# Altium schematic sheet Audio_SpeakerDriver.SchDoc
size A4; SheetNumber: 3; SheetTotal: 6
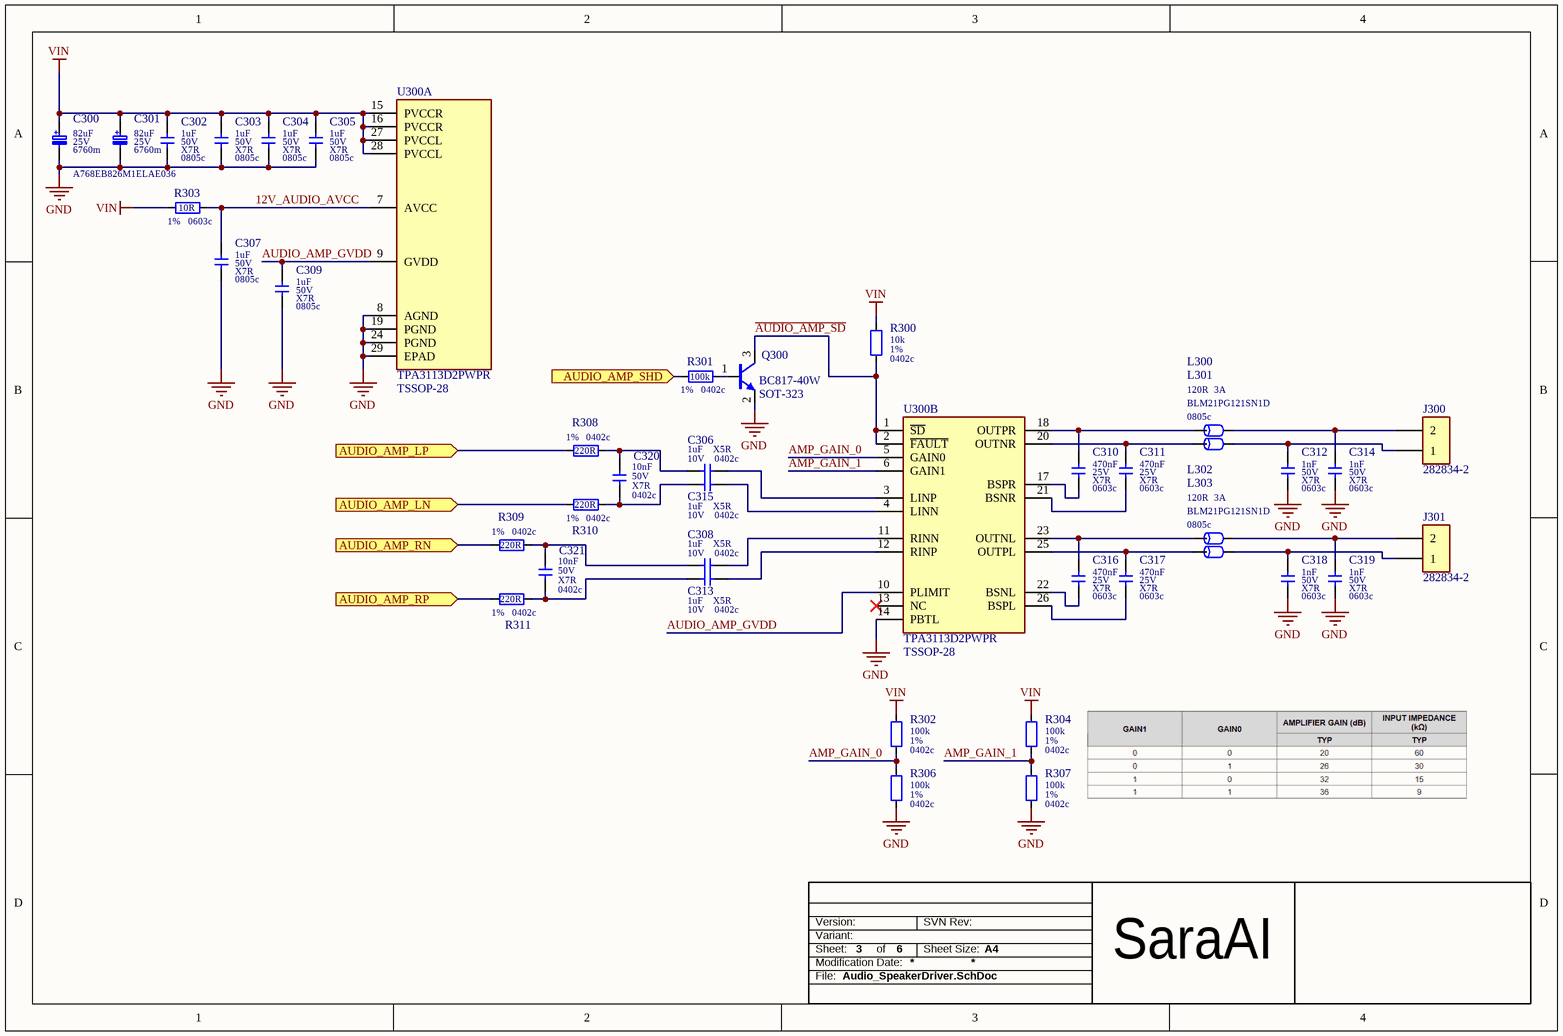
[diagram p0: Audio_SpeakerDriver.SchDoc]

## Parts
C300  09 Parameter 2: 25V  08 Parameter 1: 82uF  07 Package: 6760m  [CAPAE660X60L]  (hidden comment: A768EB826M1ELAE036)
C301  09 Parameter 2: 25V  08 Parameter 1: 82uF  07 Package: 6760m  [CAPAE660X60L]  (hidden comment: A768EB826M1ELAE036)
C302  11 Parameter 4: X7R  07 Package: 0805c  08 Parameter 1: 1uF  09 Parameter 2: 50V  [CAPC2013X145L]  (hidden comment: CL21B105KBFNNNG)
C303  11 Parameter 4: X7R  07 Package: 0805c  08 Parameter 1: 1uF  09 Parameter 2: 50V  [CAPC2013X145L]  (hidden comment: CL21B105KBFNNNG)
C304  11 Parameter 4: X7R  07 Package: 0805c  08 Parameter 1: 1uF  09 Parameter 2: 50V  [CAPC2013X145L]  (hidden comment: CL21B105KBFNNNG)
C305  11 Parameter 4: X7R  07 Package: 0805c  08 Parameter 1: 1uF  09 Parameter 2: 50V  [CAPC2013X145L]  (hidden comment: CL21B105KBFNNNG)
C306  11 Parameter 4: X5R  07 Package: 0402c  08 Parameter 1: 1uF  09 Parameter 2: 10V  [CAPC1005X60L]  (hidden comment: CL05A105KP5NNNC)
C307  11 Parameter 4: X7R  07 Package: 0805c  08 Parameter 1: 1uF  09 Parameter 2: 50V  [CAPC2013X145L]  (hidden comment: CL21B105KBFNNNG)
C308  11 Parameter 4: X5R  07 Package: 0402c  08 Parameter 1: 1uF  09 Parameter 2: 10V  [CAPC1005X60L]  (hidden comment: CL05A105KP5NNNC)
C309  11 Parameter 4: X7R  07 Package: 0805c  08 Parameter 1: 1uF  09 Parameter 2: 50V  [CAPC2013X145L]  (hidden comment: CL21B105KBFNNNG)
C310  11 Parameter 4: X7R  07 Package: 0603c  08 Parameter 1: 470nF  09 Parameter 2: 25V  [CAPC1608X90L]  (hidden comment: CL10B474KA8NNNC)
C311  11 Parameter 4: X7R  07 Package: 0603c  08 Parameter 1: 470nF  09 Parameter 2: 25V  [CAPC1608X90L]  (hidden comment: CL10B474KA8NNNC)
C312  11 Parameter 4: X7R  07 Package: 0603c  08 Parameter 1: 1nF  09 Parameter 2: 50V  [CAPC1608X90L]  (hidden comment: CL10B102KB8NNNC)
C313  11 Parameter 4: X5R  07 Package: 0402c  08 Parameter 1: 1uF  09 Parameter 2: 10V  [CAPC1005X60L]  (hidden comment: CL05A105KP5NNNC)
C314  11 Parameter 4: X7R  07 Package: 0603c  08 Parameter 1: 1nF  09 Parameter 2: 50V  [CAPC1608X90L]  (hidden comment: CL10B102KB8NNNC)
C315  11 Parameter 4: X5R  07 Package: 0402c  08 Parameter 1: 1uF  09 Parameter 2: 10V  [CAPC1005X60L]  (hidden comment: CL05A105KP5NNNC)
C316  11 Parameter 4: X7R  07 Package: 0603c  08 Parameter 1: 470nF  09 Parameter 2: 25V  [CAPC1608X90L]  (hidden comment: CL10B474KA8NNNC)
C317  11 Parameter 4: X7R  07 Package: 0603c  08 Parameter 1: 470nF  09 Parameter 2: 25V  [CAPC1608X90L]  (hidden comment: CL10B474KA8NNNC)
C318  11 Parameter 4: X7R  07 Package: 0603c  08 Parameter 1: 1nF  09 Parameter 2: 50V  [CAPC1608X90L]  (hidden comment: CL10B102KB8NNNC)
C319  11 Parameter 4: X7R  07 Package: 0603c  08 Parameter 1: 1nF  09 Parameter 2: 50V  [CAPC1608X90L]  (hidden comment: CL10B102KB8NNNC)
C320  11 Parameter 4: X7R  07 Package: 0402c  08 Parameter 1: 10nF  09 Parameter 2: 50V  [CAPC1005X60L]  (hidden comment: CL05B103KB5NNN)
C321  11 Parameter 4: X7R  07 Package: 0402c  08 Parameter 1: 10nF  09 Parameter 2: 50V  [CAPC1005X60L]  (hidden comment: CL05B103KB5NNN)
J300  282834-2  [TE 282834-2]
J301  282834-2  [TE 282834-2]
L300  09 Parameter 2: 3A  08 Parameter 1: 120R  07 Package: 0805c  [INDC2013X105L]  (hidden comment: BLM21PG121SN1D)
L301  BLM21PG121SN1D  [INDC2013X105L]  (value not drawn)
L302  09 Parameter 2: 3A  08 Parameter 1: 120R  07 Package: 0805c  [INDC2013X105L]  (hidden comment: BLM21PG121SN1D)
L303  BLM21PG121SN1D  [INDC2013X105L]  (value not drawn)
Q300  07 Package: SOT-323  [SOT65P210X110-3L]  (hidden comment: BC817-40W)
R300  07 Package: 0402c  09 Parameter 2: 1%  08 Parameter 1: 10k  [RESC1005X40L]  (hidden comment: RC0402FR-0710KL)
R301  07 Package: 0402c  09 Parameter 2: 1%  08 Parameter 1: 100k  [RESC1005X40L]  (hidden comment: RC0402FR-07100KL)
R302  07 Package: 0402c  09 Parameter 2: 1%  08 Parameter 1: 100k  [RESC1005X40L]  (hidden comment: RC0402FR-07100KL)
R303  07 Package: 0603c  09 Parameter 2: 1%  08 Parameter 1: 10R  [RESC1608X55L]  (hidden comment: RC0603FR-0710RL)
R304  07 Package: 0402c  09 Parameter 2: 1%  08 Parameter 1: 100k  [RESC1005X40L]  (hidden comment: RC0402FR-07100KL)
R306  07 Package: 0402c  09 Parameter 2: 1%  08 Parameter 1: 100k  [RESC1005X40L]  (hidden comment: RC0402FR-07100KL)
R307  07 Package: 0402c  09 Parameter 2: 1%  08 Parameter 1: 100k  [RESC1005X40L]  (hidden comment: RC0402FR-07100KL)
R308  07 Package: 0402c  09 Parameter 2: 1%  08 Parameter 1: 220R  [RESC1005X40L]  (hidden comment: RC0402FR-07220RL)
R309  07 Package: 0402c  09 Parameter 2: 1%  08 Parameter 1: 220R  [RESC1005X40L]  (hidden comment: RC0402FR-07220RL)
R310  07 Package: 0402c  09 Parameter 2: 1%  08 Parameter 1: 220R  [RESC1005X40L]  (hidden comment: RC0402FR-07220RL)
R311  07 Package: 0402c  09 Parameter 2: 1%  08 Parameter 1: 220R  [RESC1005X40L]  (hidden comment: RC0402FR-07220RL)
U300  07 Package: TSSOP-28  [TSOP65P640X120_HS-29L]  (hidden comment: TPA3113D2PWPR)  (parts A,B of 2)

## Ports
AUDIO_AMP_LN (in), AUDIO_AMP_LP (in), AUDIO_AMP_RN (in), AUDIO_AMP_RP (in), AUDIO_AMP_SHD (in)

## Nets
GND: C300.2 C301.2 C302.1 C303.1 C304.1 C305.1 C307.1 C309.1 C312.1 C314.1 C318.1 C319.1 Q300.2(E) R306.1 R307.1 U300.8(AGND) U300.14(PBTL) U300.19(PGND) U300.24(PGND) U300.29(EPAD)
VIN: C300.1 C301.1 C302.2 C303.2 C304.2 C305.2 R300.2 R302.2 R303.1 R304.2 U300.15(PVCCR) U300.16(PVCCR) U300.27(PVCCL) U300.28(PVCCL)
12V_AUDIO_AVCC: C307.2 R303.2 U300.7(AVCC)
~{AUDIO_AMP_SD}: Q300.3(C) R300.1 U300.1(~{SD}) U300.2(~{FAULT})
AMP_GAIN_0: R302.1 R306.2 U300.5(GAIN0)
AMP_GAIN_1: R304.1 R307.2 U300.6(GAIN1)
AUDIO_AMP_GVDD: C309.2 U300.9(GVDD) U300.10(PLIMIT)
AUDIO_AMP_LN: R310.1 ; port AUDIO_AMP_LN
AUDIO_AMP_LP: R308.1 ; port AUDIO_AMP_LP
AUDIO_AMP_RN: R309.1 ; port AUDIO_AMP_RN
AUDIO_AMP_RP: R311.1 ; port AUDIO_AMP_RP
AUDIO_AMP_SHD: R301.1 ; port AUDIO_AMP_SHD
NetC306_1: C306.1 U300.3(LINP)
NetC306_2: C306.2 C320.2 R308.2
NetC308_1: C308.1 U300.11(RINN)
NetC308_2: C308.2 C321.2 R309.2
NetC310_1: C310.1 U300.17(BSPR)
NetC310_2: C310.2 L300.1 U300.18(OUTPR)
NetC311_1: C311.1 U300.21(BSNR)
NetC311_2: C311.2 L301.1 U300.20(OUTNR)
NetC312_2: C312.2 J300.1 L301.2
NetC313_1: C313.1 U300.12(RINP)
NetC313_2: C313.2 C321.1 R311.2
NetC314_2: C314.2 J300.2 L300.2
NetC315_1: C315.1 U300.4(LINN)
NetC315_2: C315.2 C320.1 R310.2
NetC316_1: C316.1 U300.22(BSNL)
NetC316_2: C316.2 L302.1 U300.23(OUTNL)
NetC317_1: C317.1 U300.26(BSPL)
NetC317_2: C317.2 L303.1 U300.25(OUTPL)
NetC318_2: C318.2 J301.1 L303.2
NetC319_2: C319.2 J301.2 L302.2
NetQ300_1: Q300.1(B) R301.2

Not connected (* = marked no-connect by the designer): U300 13(NC)*

## Notes on the sheet
- Version:
- SVN Rev:
- Sheet:
- File:
- Modification Date:
- Variant:
- of
- Sheet Size:
- A4
- SaraAI
- (in symbol 498) +

## Library data of the parts
C300 C301 = 498: SMT 6760m 82uF 25V 0,2 36mOhm 1.255A 125°; 03 Manufacturer: Kemet; 00 Index: 498; 01 Name: CAPACITOR POLYMER A768EB826M1ELAE036 Kemet; 04 Main Group: CAPACITOR; 05 Sub Group: POLYMER; 10 Parameter 3: 0,2; 16 Replacements: 25SVPK82M; Library Directory: sym_basics/; Fotprint Directory: fot_ipc/; 06 Assembly: SMT; 11 Parameter 4: 36mOhm; 12 Parameter 5: 1.255A; 13 Parameter 6: 125°; 14 Modification Date: 09.03.2021; ComponentLink1Description: DATASHEET; ComponentLink1URL: https://pl.mouser.com/datasheet/2/212/1/KEM_A4088_A768-1864506.pdf; 02 MPN: A768EB826M1ELAE036
C302-C305 C307 C309 = 30: SMT 0805c 1uF 50V 10% X7R 6.9MHz 125'C; 03 Manufacturer: Samsung; 00 Index: 30; 01 Name: CAPACITOR CERAMIC CL21B105KBFNNNG Samsung; 05 Sub Group: CERAMIC; 04 Main Group: CAPACITOR; 06 Assembly: SMT; 12 Parameter 5: 6.9MHz; 13 Parameter 6: 125'C; 14 Modification Date: 16.11.2020; ComponentLink1Description: DATASHEET; ComponentLink1URL: E:\Praca\Mindsailors\Mindsailors Altium\Database Library\Datasheets\CAPACITOR\Samsung CL21B105KBFNNNG.pdf; 02 MPN: CL21B105KBFNNNG; 10 Parameter 3: 10%
C306 C308 C313 C315 = 154: SMT 0402c 1uF 10V 10% X5R 10.2MHz 85'C; 03 Manufacturer: Samsung; 00 Index: 154; 01 Name: CAPACITOR THICK FILM CL05A105KP5NNNC Samsung; 05 Sub Group: THICK FILM; 04 Main Group: CAPACITOR; 06 Assembly: SMT; 12 Parameter 5: 10.2MHz; 13 Parameter 6: 85'C; 14 Modification Date: 16.11.2020; ComponentLink1Description: DATASHEET; ComponentLink1URL: E:\Praca\Mindsailors\Mindsailors Altium\Database Library\Datasheets\CAPACITOR\Samsung CL05A105KP5NNNC.pdf; 02 MPN: CL05A105KP5NNNC; 10 Parameter 3: 10%
C310 C311 C316 C317 = 212: SMT 0603c 470nF 25V 10% X7R 125°C; 03 Manufacturer: Samsung; 00 Index: 212; 01 Name: CAPACITOR CERAMIC CL10B474KA8NNNC Samsung; 05 Sub Group: CERAMIC; 04 Main Group: CAPACITOR; 06 Assembly: SMT; 13 Parameter 6: 125°C; 14 Modification Date: 25.01.2021; ComponentLink1Description: DATASHEET; ComponentLink1URL: http://weblib.samsungsem.com/mlcc/mlcc-ec-data-sheet.do?partNumber=CL10B474KA8NNN; 02 MPN: CL10B474KA8NNNC; 10 Parameter 3: 10%
C312 C314 C318 C319 = 191: SMT 0603c 1nF 50V 10% X7R 125°C; 03 Manufacturer: Samsung; 00 Index: 191; 01 Name: CAPACITOR CERAMIC CL10B102KB8NNNC Samsung; 05 Sub Group: CERAMIC; Library Directory: sym_basics/; Fotprint Directory: fot_ipc/; 04 Main Group: CAPACITOR; 06 Assembly: SMT; 13 Parameter 6: 125°C; 14 Modification Date: 25.01.2021; ComponentLink1Description: DATASHEET; ComponentLink1URL: http://weblib.samsungsem.com/mlcc/mlcc-ec-data-sheet.do?partNumber=CL10B102KB8NNN; 02 MPN: CL10B102KB8NNNC; 10 Parameter 3: 10%
C320 C321 = 451: SMT 0402c 10nF 50V 0,1 X7R 125°C; 03 Manufacturer: Samsung; 00 Index: 451; 01 Name: CAPACITOR CERAMIC CL05B103KB5NNN Samsung; 05 Sub Group: CERAMIC; 10 Parameter 3: 10%; 04 Main Group: CAPACITOR; 06 Assembly: SMT; 13 Parameter 6: 125°C; 14 Modification Date: 11.02.2021; ComponentLink1Description: DATASHEET; ComponentLink1URL: http://weblib.samsungsem.com/mlcc/mlcc-ec-data-sheet.do?partNumber=CL05B103KB5NNN; 02 MPN: CL05B103KB5NNN
J300 J301 = 978: THT 1x2 2.54mm Straight 150V 10A; 03 Manufacturer: TE Connectivity; 00 Index: 978; 01 Name: CONNECTOR WIRE 282834-2 TE Connectivity; 04 Main Group: CONNECTOR; 05 Sub Group: WIRE; Library Directory: sym_basics/; Fotprint Directory: fot_other/; 06 Assembly: THT; 13 Parameter 6: 10A; 14 Modification Date: 03.01.2022; ComponentLink1Description: DATASHEET; ComponentLink1URL: https://www.te.com/usa-en/product-282834-2.html; 09 Parameter 2: 2.54mm; 08 Parameter 1: 1x2; 11 Parameter 4: Straight; 12 Parameter 5: 150V; 07 Package: *; 02 MPN: 282834-2
L300-L303 = 499: SMT 0805c 120R 3A 0.035Ohm 350MHz; 03 Manufacturer: Murata; 00 Index: 499; 01 Name: INDUCTOR BEAD BLM21PG121SN1D Murata; 04 Main Group: INDUCTOR; 05 Sub Group: BEAD; 06 Assembly: SMT; 12 Parameter 5: 0.035Ohm; 13 Parameter 6: 350MHz; 14 Modification Date: 09.03.2021; ComponentLink1Description: DATASHEET; ComponentLink1URL: https://www.murata.com/en-global/api/pdfdownloadapi?cate=cgsubChipFerriBead&partno=BLM21PG121SZ1%23; 02 MPN: BLM21PG121SN1D
  L301 L303: 09 Parameter 2: 3A; 08 Parameter 1: 120R; 07 Package: 0805c
Q300 = 93: SMT SOT-323 NPN 45V 0.5A 0.2W; 03 Manufacturer: Nexperia; 00 Index: 93; 01 Name: TRANSISTOR BIPOLAR BC817-40W Nexperia; 04 Main Group: TRANSISTOR; 05 Sub Group: BIPOLAR; 06 Assembly: SMT; 13 Parameter 6: 0.2W; 14 Modification Date: 16.11.2020; ComponentLink1Description: DATASHEET; ComponentLink1URL: E:\Praca\Mindsailors\Mindsailors Altium\Database Library\Datasheets\TRANSISTOR\Nexperia BC817W Series.pdf; 08 Parameter 1: NPN; 11 Parameter 4: 45V; 12 Parameter 5: 0.5A; 02 MPN: BC817-40W
R300 = 15: SMT 0402c 10k 1% 62.5mW 100ppm/K 50V; 03 Manufacturer: Yageo; 00 Index: 15; 01 Name: RESISTOR THICK FILM RC0402FR-0710KL Yageo; 05 Sub Group: THICK FILM; 04 Main Group: RESISTOR; 06 Assembly: SMT; 11 Parameter 4: 100ppm/K; 12 Parameter 5: 50V; 14 Modification Date: 16.11.2020; ComponentLink1Description: DATASHEET; ComponentLink1URL: E:\Praca\Mindsailors\Mindsailors Altium\Database Library\Datasheets\RESISTOR\Yageo RC_L Series.pdf; 10 Parameter 3: 62.5mW; 02 MPN: RC0402FR-0710KL
R301 = 18: SMT 0402c 100k 1% 62.5mW 100ppm/K 50V; 03 Manufacturer: Yageo; 00 Index: 18; 01 Name: RESISTOR THICK FILM RC0402FR-07100KL Yageo; 05 Sub Group: THICK FILM; 04 Main Group: RESISTOR; 06 Assembly: SMT; 11 Parameter 4: 100ppm/K; 12 Parameter 5: 50V; 14 Modification Date: 16.11.2020; ComponentLink1Description: DATASHEET; ComponentLink1URL: E:\Praca\Mindsailors\Mindsailors Altium\Database Library\Datasheets\RESISTOR\Yageo RC_L Series.pdf; 10 Parameter 3: 62.5mW; 02 MPN: RC0402FR-07100KL
R302 R304 R306 R307 = 18: SMT 0402c 100k 1% 62.5mW 100ppm/K 50V; 03 Manufacturer: Yageo; 00 Index: 18; 01 Name: RESISTOR THICK FILM RC0402FR-07100KL Yageo; 05 Sub Group: THICK FILM; Library Directory: sym_basics/; Fotprint Directory: fot_ipc/; 04 Main Group: RESISTOR; 06 Assembly: SMT; 11 Parameter 4: 100ppm/K; 12 Parameter 5: 50V; 14 Modification Date: 16.11.2020; ComponentLink1Description: DATASHEET; ComponentLink1URL: E:\Praca\Mindsailors\Mindsailors Altium\Database Library\Datasheets\RESISTOR\Yageo RC_L Series.pdf; 10 Parameter 3: 62.5mW; 02 MPN: RC0402FR-07100KL
R303 = 265: SMT 0603c 10R 1% 100mW 100ppm/K 75V; 03 Manufacturer: Yageo; 00 Index: 265; 01 Name: RESISTOR THICK FILM RC0603FR-0710RL Yageo; 05 Sub Group: THICK FILM; 04 Main Group: RESISTOR; 06 Assembly: SMT; 11 Parameter 4: 100ppm/K; 12 Parameter 5: 75V; 14 Modification Date: 25.01.2021; ComponentLink1Description: DATASHEET; ComponentLink1URL: https://www.yageo.com/upload/media/product/products/datasheet/rchip/PYu-RC_Group_51_RoHS_L_11.pdf; 10 Parameter 3: 100mW; 02 MPN: RC0603FR-0710RL
R308-R311 = 605: SMT 0402c 220R 1% 62.5mW 100ppm/K 50V; 03 Manufacturer: Yageo; 00 Index: 605; 01 Name: RESISTOR THICK FILM RC0402FR-07220RL Yageo; 05 Sub Group: THICK FILM; Library Directory: sym_basics/; Fotprint Directory: fot_ipc/; 04 Main Group: RESISTOR; 06 Assembly: SMT; 11 Parameter 4: 100ppm/K; 12 Parameter 5: 50V; 14 Modification Date: 10.05.2021; ComponentLink1Description: DATASHEET; ComponentLink1URL: https://www.yageo.com/upload/media/product/products/datasheet/rchip/PYu-RC_Group_51_RoHS_L_11.pdf; 10 Parameter 3: 62.5mW; 02 MPN: RC0402FR-07220RL
U300 = 497: SMT TSSOP-28 Speaker 8V - 26V 2x 6W; 03 Manufacturer: Texas Instruments; 00 Index: 497; 01 Name: IC DRIVER TPA3113D2PWPR Texas Instruments; 04 Main Group: IC; 05 Sub Group: DRIVER; 11 Parameter 4: 8V - 26V; 12 Parameter 5: 2x 6W; 06 Assembly: SMT; 14 Modification Date: 08.03.2021; ComponentLink1Description: DATASHEET; ComponentLink1URL: https://www.ti.com/lit/ds/symlink/tpa3113d2.pdf?ts=1615202642368&ref_url=https%253A%252F%252Fwww.google.com%252F; 08 Parameter 1: Speaker; 02 MPN: TPA3113D2PWPR